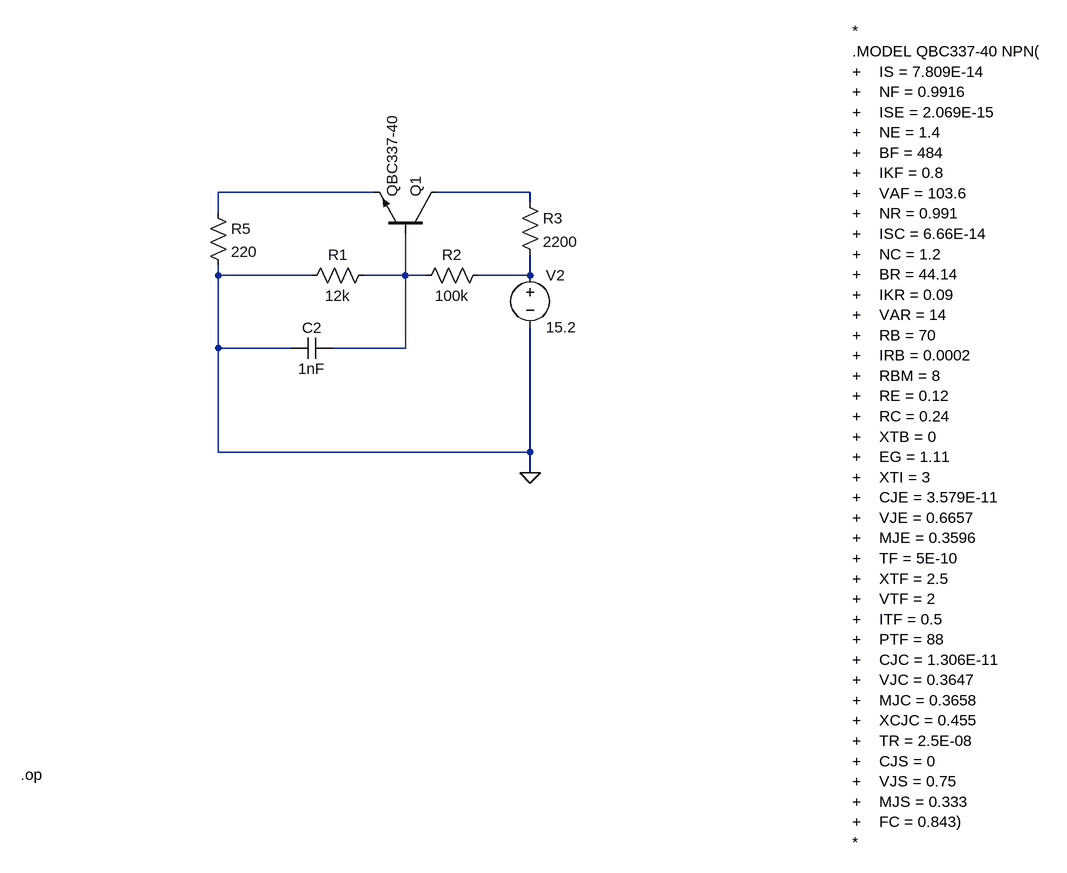
[diagram p0: schematic sim_normalizada.asc]
sim_normalizada.asc, the LTspice schematic file:
Version 4
SHEET 1 1188 880
WIRE 144 -32 -96 -32
WIRE 384 -32 240 -32
WIRE 384 -16 384 -32
WIRE -96 0 -96 -32
WIRE -96 96 -96 80
WIRE 48 96 -96 96
WIRE 192 96 192 32
WIRE 192 96 128 96
WIRE 224 96 192 96
WIRE 384 96 384 64
WIRE 384 96 304 96
WIRE -96 208 -96 96
WIRE 16 208 -96 208
WIRE 192 208 192 96
WIRE 192 208 80 208
WIRE -96 368 -96 208
WIRE 384 368 384 176
WIRE 384 368 -96 368
WIRE 384 400 384 368
FLAG 384 400 0
DATAFLAG 272 -32 "$-V(N003)"
SYMBOL npn 240 32 M270
SYMATTR InstName Q1
SYMATTR Value QBC337-40
SYMBOL res 144 80 R90
WINDOW 0 0 56 VBottom 2
WINDOW 3 32 56 VTop 2
SYMATTR InstName R1
SYMATTR Value 12k
SYMBOL res 320 80 R90
WINDOW 0 0 56 VBottom 2
WINDOW 3 32 56 VTop 2
SYMATTR InstName R2
SYMATTR Value 100k
SYMBOL res 368 -32 R0
SYMATTR InstName R3
SYMATTR Value 2200
SYMBOL res -112 -16 R0
SYMATTR InstName R5
SYMATTR Value 220
SYMBOL cap 80 192 R90
WINDOW 0 0 32 VBottom 2
WINDOW 3 32 32 VTop 2
SYMATTR InstName C2
SYMATTR Value 1nF
SYMBOL voltage 384 80 R0
WINDOW 123 0 0 Left 0
WINDOW 39 0 0 Left 0
SYMATTR InstName V2
SYMATTR Value 15.2
TEXT 880 -280 Left 2 !*\n.MODEL QBC337-40 NPN( \n+    IS = 7.809E-14 \n+    NF = 0.9916 \n+    ISE = 2.069E-15 \n+    NE = 1.4 \n+    BF = 484\n+    IKF = 0.8 \n+    VAF = 103.6 \n+    NR = 0.991 \n+    ISC = 6.66E-14 \n+    NC = 1.2 \n+    BR = 44.14 \n+    IKR = 0.09 \n+    VAR = 14 \n+    RB = 70 \n+    IRB = 0.0002 \n+    RBM = 8 \n+    RE = 0.12 \n+    RC = 0.24 \n+    XTB = 0 \n+    EG = 1.11 \n+    XTI = 3 \n+    CJE = 3.579E-11 \n+    VJE = 0.6657 \n+    MJE = 0.3596 \n+    TF = 5E-10 \n+    XTF = 2.5 \n+    VTF = 2 \n+    ITF = 0.5 \n+    PTF = 88 \n+    CJC = 1.306E-11 \n+    VJC = 0.3647 \n+    MJC = 0.3658 \n+    XCJC = 0.455 \n+    TR = 2.5E-08 \n+    CJS = 0 \n+    VJS = 0.75 \n+    MJS = 0.333 \n+    FC = 0.843) \n*
TEXT -400 864 Left 2 !.op

The netlist it stands for:
* sim_normalizada.asc
Q1 N002 N003 N001 0 QBC337-40
R1 N003 0 12k
R2 N004 N003 100k
R3 N002 N004 2200
R5 N001 0 220
C2 N003 0 1nF
V2 N004 0 15.2
.model NPN NPN
.model PNP PNP
.lib standard.bjt
*
.MODEL QBC337-40 NPN(
+    IS = 7.809E-14
+    NF = 0.9916
+    ISE = 2.069E-15
+    NE = 1.4
+    BF = 484
+    IKF = 0.8
+    VAF = 103.6
+    NR = 0.991
+    ISC = 6.66E-14
+    NC = 1.2
+    BR = 44.14
+    IKR = 0.09
+    VAR = 14
+    RB = 70
+    IRB = 0.0002
+    RBM = 8
+    RE = 0.12
+    RC = 0.24
+    XTB = 0
+    EG = 1.11
+    XTI = 3
+    CJE = 3.579E-11
+    VJE = 0.6657
+    MJE = 0.3596
+    TF = 5E-10
+    XTF = 2.5
+    VTF = 2
+    ITF = 0.5
+    PTF = 88
+    CJC = 1.306E-11
+    VJC = 0.3647
+    MJC = 0.3658
+    XCJC = 0.455
+    TR = 2.5E-08
+    CJS = 0
+    VJS = 0.75
+    MJS = 0.333
+    FC = 0.843)
*
.op
.backanno
.end